# EAGLE design resisdelit (EAGLE 9.6.2)
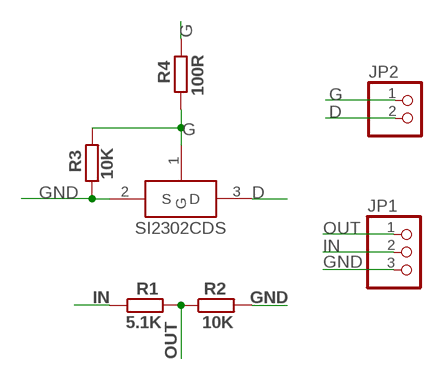
[diagram p0: schematic, sheet 1]

## Parts
JP1  PINHD-1X3  [1X03]
JP2  PINHD-1X2  [1X02]
R1  5.1K  R-EU_R0603  [R0603]
R2  10K  R-EU_R0603  [R0603]
R3  10K  R-EU_R0603  [R0603]
R4  100R  R-EU_R0603  [R0603]
SI2300A  SI2302CDS  [SOT23-3]

## Nets
D: JP2.2 SI2300A.3(D)
G: JP2.1 R3.2 R4.1 R4.2 SI2300A.1(G)
GND: JP1.3 R2.2 R3.1 SI2300A.2(S)
IN: JP1.2 R1.1
OUT: JP1.1 R1.2 R2.1

## Library data of the parts
JP1 = pinhead:PINHD-1X3: PIN HEADER
JP2 = pinhead:PINHD-1X2: PIN HEADER
R1-R4 = rcl:R-EU_: RESISTOR, European symbol; SPICEPREFIX: R
SI2300A = CanCubeSat:SI2302CDS

## Board
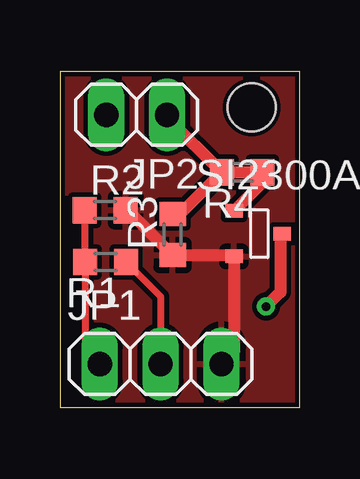
[diagram p1: board, top side]
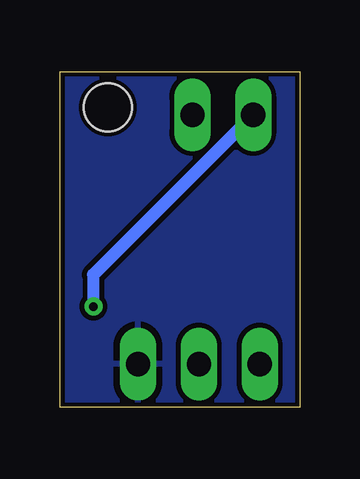
[diagram p2: board, bottom side, seen from below]

Size 10 x 14 mm. Coordinates in mm from the lower left corner, seen from the top.
Outline: 0,0 10,0 10,14 0,14 0,0
Copper layers (1*16): Top 0.035mm / dielectric 1.5mm / Bottom 0.035mm
Design rules "default *": minimum track width 6mil, minimum drill 0.35mm, track to track 0.2mm, track to pad 0.2mm, pad to pad 0.2mm, via to via 0.2mm, smd to smd 0.2mm, copper to edge 0.2mm, drill to drill 0.2mm, minimum pad ring 10mil, minimum via ring 8mil, stop-mask expansion 4mil, vias tented up to drill 0mil, thermal gap 10mil
Holes 2 mm at 8,12.5

### Footprints (pad centres in the part's own frame; a part is rotated, then mirrored left to right if it is on the bottom)
1X03 = drill 1.016 long: 1 -2.54,0; 2 0,0; 3 2.54,0
1X02 = drill 1.016 long: 1 -1.27,0; 2 1.27,0
R0603 = smd 1 x 1.1: 1 -0.85,0; 2 0.85,0
SOT23-3 = smd 0.56 x 0.73: 1 -0.95,-1; 2 0.95,-1; 3 0,1

### Placement (x,y rotation side)
JP1  4.2,1.8 0 top
JP2  3.2,12.2 180 top
R1  1.91,6.06 180 top
R2  1.89,8.22 0 top
R3  4.7,7.2 90 top
R4  7.6,9.8 180 top
SI2300A  8.27,7.24 270 top

### Tracks (layer width: path | path; a pad name or v marks a point on that pad's centre or on a via)
D  (via drill 0.35)
  Top 0.25: SI2300A.3 9.2,7.17
  Top 0.5: 9.2,7.17 9.2,4.8 v8.6,4.2
  Bottom 0.5: v8.6,4.2 8.6,5.53
  Bottom 0.55: 8.6,5.53 JP2.2
G
  Top 0.25: 5,8.05 R3.2 | 8.45,9.37 R4.1 | JP2.1 4.47,12.08
  Top 0.5: R4.2 R4.1 | R4.2 5,8.05 | SI2300A.1 8.45,9.37 | 4.47,12.08 R4.2
GND
  Top 0.25: R2.2 2.83,8.22 | 7.21,6.35 SI2300A.2
  Top 0.5: 2.83,8.22 R3.1 7.21,6.35 | SI2300A.2 7.27,2.33 JP1.3
  pour Top: 0,14 0,0 10,0 10,14
  pour Bottom: 0,14 10,14 10,0 0,0
IN
  Top 0.3: R1.1 4.2,4.62 JP1.2
OUT
  Top 0.25: R1.2 1.04,6.08
  Top 0.3: R2.1 1.04,6.08 | R1.2 1.06,2.4 JP1.1

### Text on the board
tValues: D | G | OUT | IN | GND